# EAGLE design guitar_tuner (EAGLE 9.6.2)
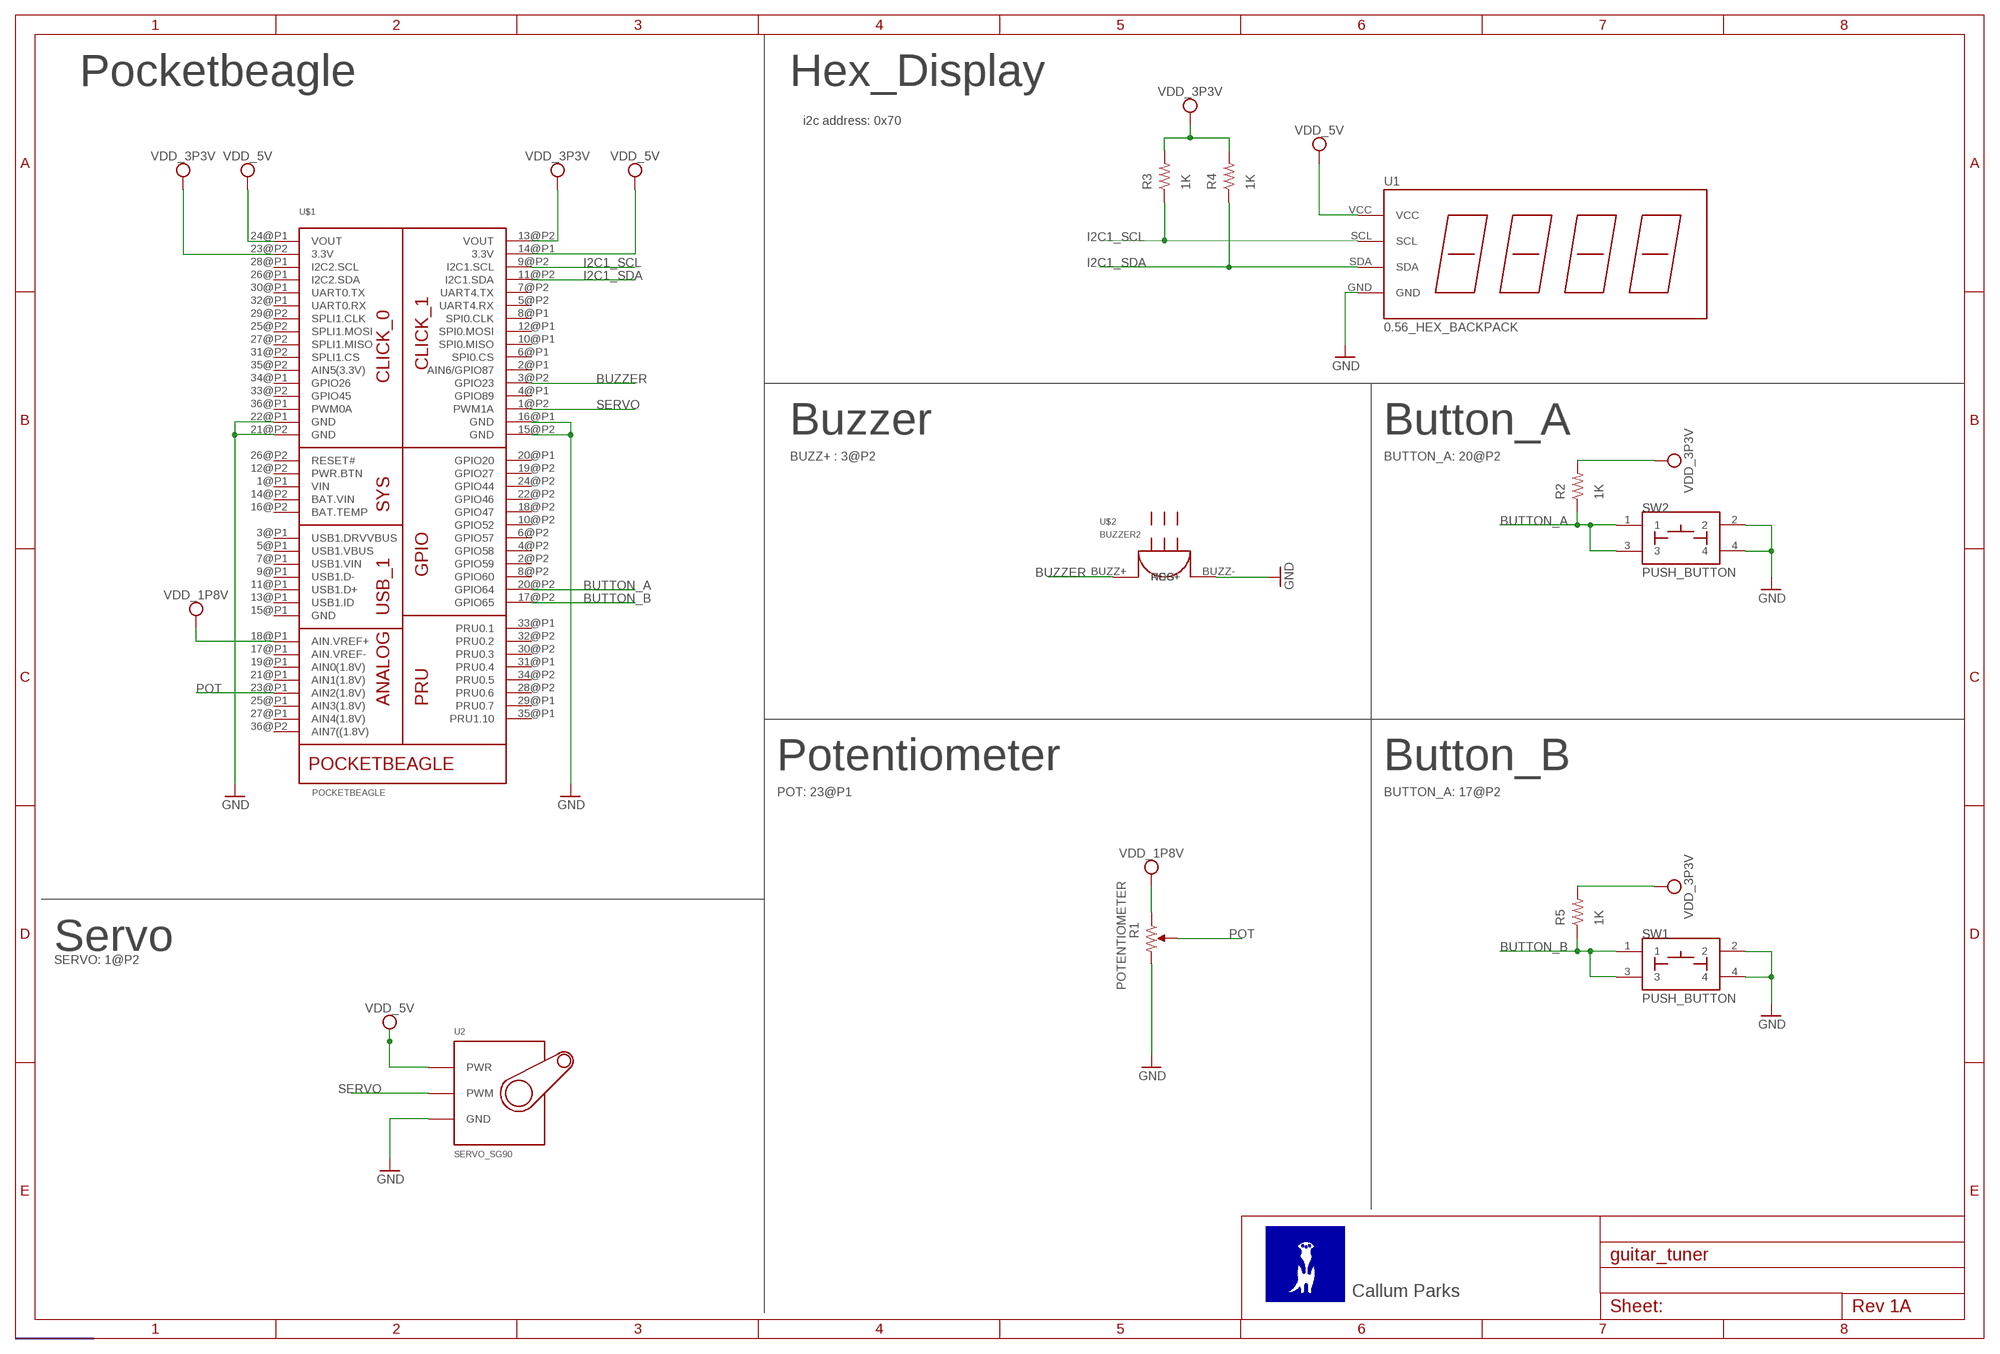
[diagram p0: schematic, sheet 1]

## Parts
R1  POTENTIOMETER  [POT-PO90S]
R2  1K  R_R0402  [R0402]
R3  1K  R_R0402  [R0402]
R4  1K  R_R0402  [R0402]
R5  1K  R_R0402  [R0402]
SW1  PUSH_BUTTON  [BUTTON_12.5MM]
SW2  PUSH_BUTTON  [BUTTON_12.5MM]
U1  0.56_HEX_BACKPACK  [0.56_HEX_BACKPACK]
U2  SERVO_SG90  [SERVO-X1]
U$1  POCKETBEAGLE  [POCKETBEAGLE]
U$2  BUZZER2  [BUZZER2]

## Nets
BUTTON_A: R2.1 SW2.1 SW2.3 U$1.20@P2(GPIO64)
BUTTON_B: R5.1 SW1.1 SW1.3 U$1.17@P2(GPIO65)
BUZZER: U$1.3@P2(GPIO23) U$2.BUZZ+(POS+)
GND: R1.CW SW1.2 SW1.4 SW2.2 SW2.4 U1.GND U2.GND U$1.15@P2(GND) U$1.16@P1(GND) U$1.21@P2(GND) U$1.22@P1(GND) U$2.BUZZ-(NEG-)
I2C1_SCL: U1.SCL U$1.9@P2(I2C1.SCL)
I2C1_SDA: R4.1 U1.SDA U$1.11@P2(I2C1.SDA)
N$1: R3.1
POT: R1.S U$1.23@P1(AIN2(1.8V))
SERVO: U2.SIG(PWM) U$1.1@P2(PWM1A)
VDD_3P3V: R1.CCW R2.2 R3.2 R4.2 R5.2 U$1.13@P2(VOUT) U$1.18@P1(AIN.VREF+) U$1.23@P2(3.3V) ; supply symbol labelled VDD_1P8V
VDD_5V: U1.VCC U2.PWR U$1.14@P1(3.3V) U$1.24@P1(VOUT)
Unconnected: U$1.1@P1(VIN) U$1.2@P1(AIN6/GPIO87) U$1.2@P2(GPIO59) U$1.3@P1(USB1.DRVVBUS) U$1.4@P1(GPIO89) U$1.4@P2(GPIO58) U$1.5@P1(USB1.VBUS) U$1.5@P2(UART4.RX) U$1.6@P1(SPI0.CS) U$1.6@P2(GPIO57) U$1.7@P1(USB1.VIN) U$1.7@P2(UART4.TX) U$1.8@P1(SPI0.CLK) U$1.8@P2(GPIO60) U$1.9@P1(USB1.D-) U$1.10@P1(SPI0.MISO) U$1.10@P2(GPIO52) U$1.11@P1(USB1.D+) U$1.12@P1(SPI0.MOSI) U$1.12@P2(PWR.BTN) U$1.13@P1(USB1.ID) U$1.14@P2(BAT.VIN) U$1.15@P1(GND) U$1.16@P2(BAT.TEMP) U$1.17@P1(AIN.VREF-) U$1.18@P2(GPIO47) U$1.19@P1(AIN0(1.8V)) U$1.19@P2(GPIO27) U$1.20@P1(GPIO20) U$1.21@P1(AIN1(1.8V)) U$1.22@P2(GPIO46) U$1.24@P2(GPIO44) U$1.25@P1(AIN3(1.8V)) U$1.25@P2(SPLI1.MOSI) U$1.26@P1(I2C2.SDA) U$1.26@P2(RESET#) U$1.27@P1(AIN4(1.8V)) U$1.27@P2(SPLI1.MISO) U$1.28@P1(I2C2.SCL) U$1.28@P2(PRU0.6) U$1.29@P1(PRU0.7) U$1.29@P2(SPLI1.CLK) U$1.30@P1(UART0.TX) U$1.30@P2(PRU0.3) U$1.31@P1(PRU0.4) U$1.31@P2(SPLI1.CS) U$1.32@P1(UART0.RX) U$1.32@P2(PRU0.2) U$1.33@P1(PRU0.1) U$1.33@P2(GPIO45) U$1.34@P1(GPIO26) U$1.34@P2(PRU0.5) U$1.35@P1(PRU1.10) U$1.35@P2(AIN5(3.3V)) U$1.36@P1(PWM0A) U$1.36@P2(AIN7((1.8V))

## Notes on the sheet
- Pocketbeagle | Hex_Display
- i2c address: 0x70
- Buzzer | Button_A
- BUZZ+ : 3@P2 | BUTTON_A: 20@P2
- Potentiometer | Button_B
- POT: 23@P1 | BUTTON_A: 17@P2
- Servo
- SERVO: 1@P2
- Callum Parks

## Library data of the parts
R1 = ENGI301:POTENTIOMETER: Potentiometer - Examples: P090S-14T20BR10K (987-1277-ND)
R2-R5 = ENGI301:R_: RESISTOR, American symbol
SW1 SW2 = ENGI301:PUSH_BUTTON
U1 = ENGI301:0.56_HEX_BACKPACK: 0.56" LED HEX Backback - Adafruit HT16K33 - https://www.adafruit.com/product/878 - https://www.adafruit.com/product/879 - https://www.adafruit.com/product/880 - https://www.adafruit.com/product/881 - https://www.adafruit.com/product/1002
U2 = ENGI301:SERVO_SG90
U$1 = ENGI301:POCKETBEAGLE
U$2 = ENGI301:BUZZER2

## Board
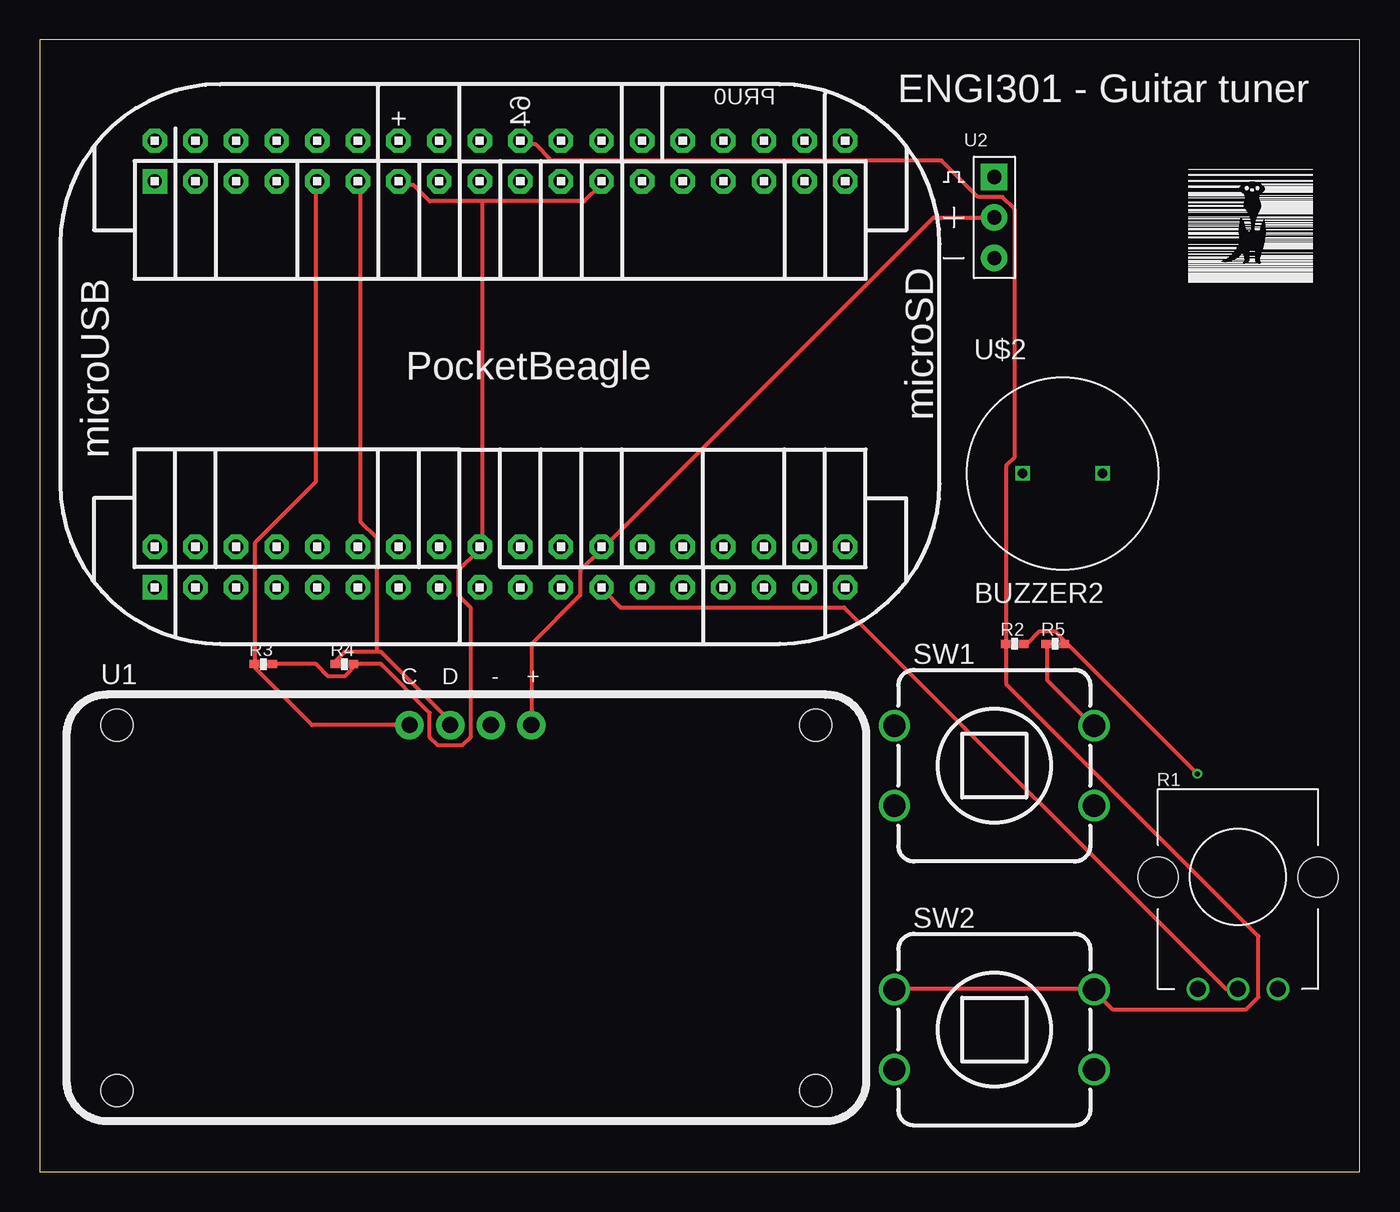
[diagram p1: board, top side]
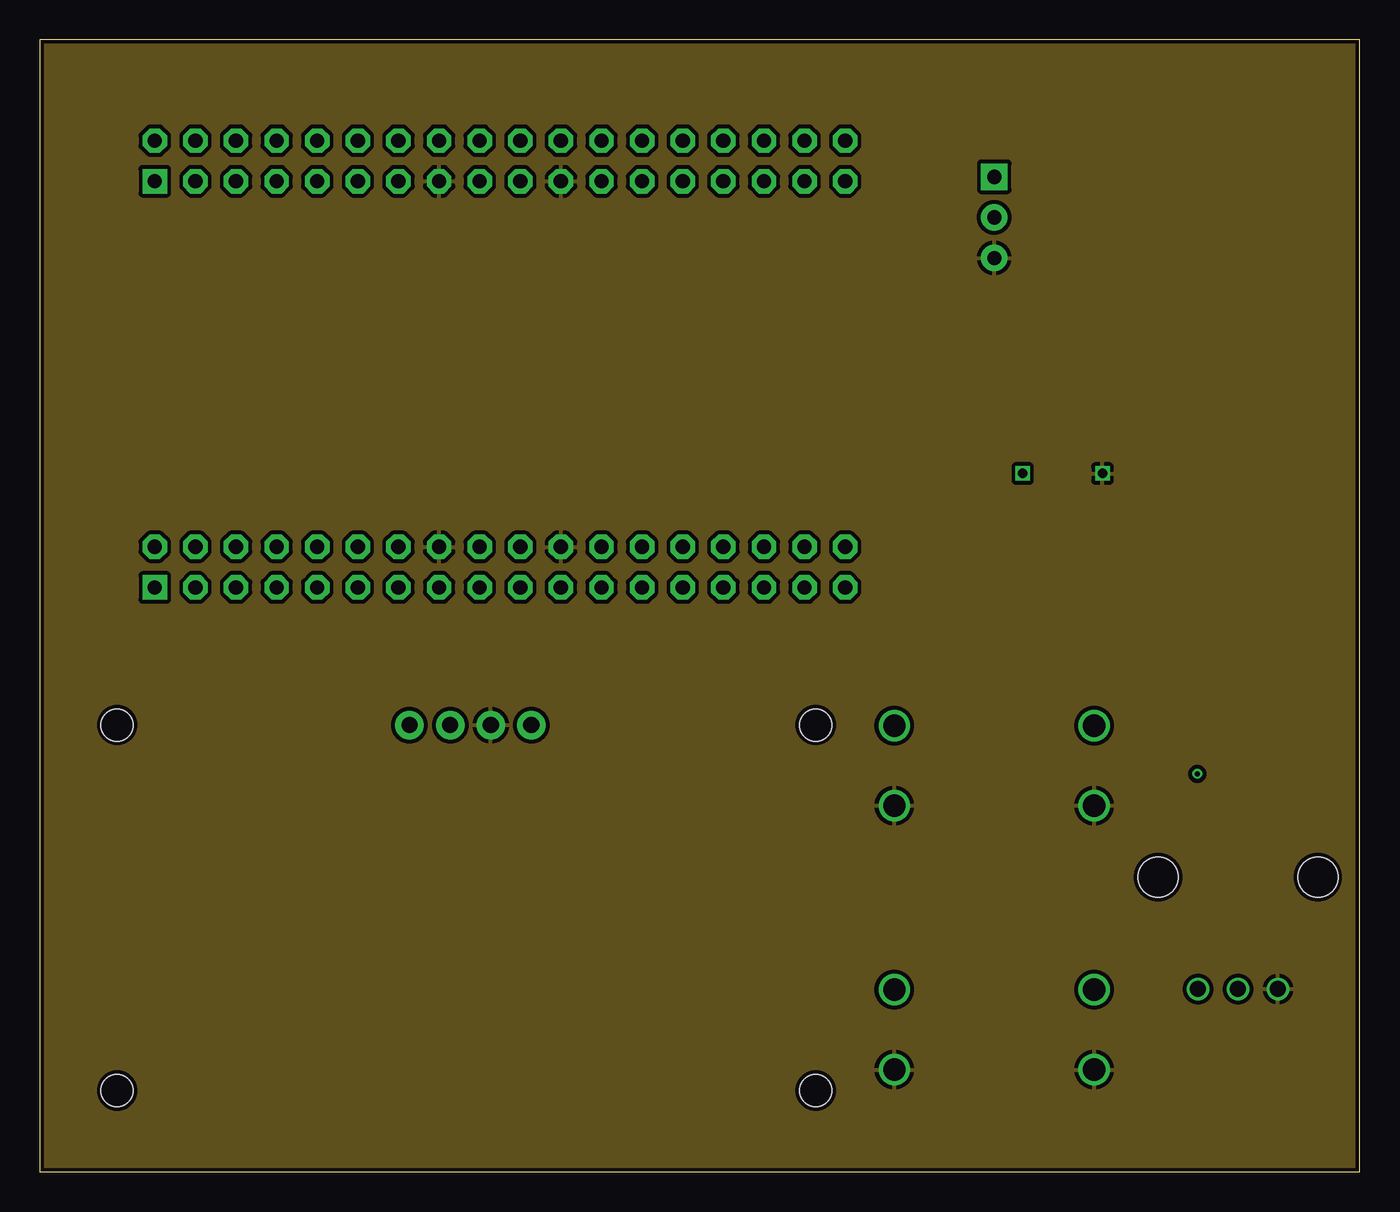
[diagram p2: board, inner layer Route2]
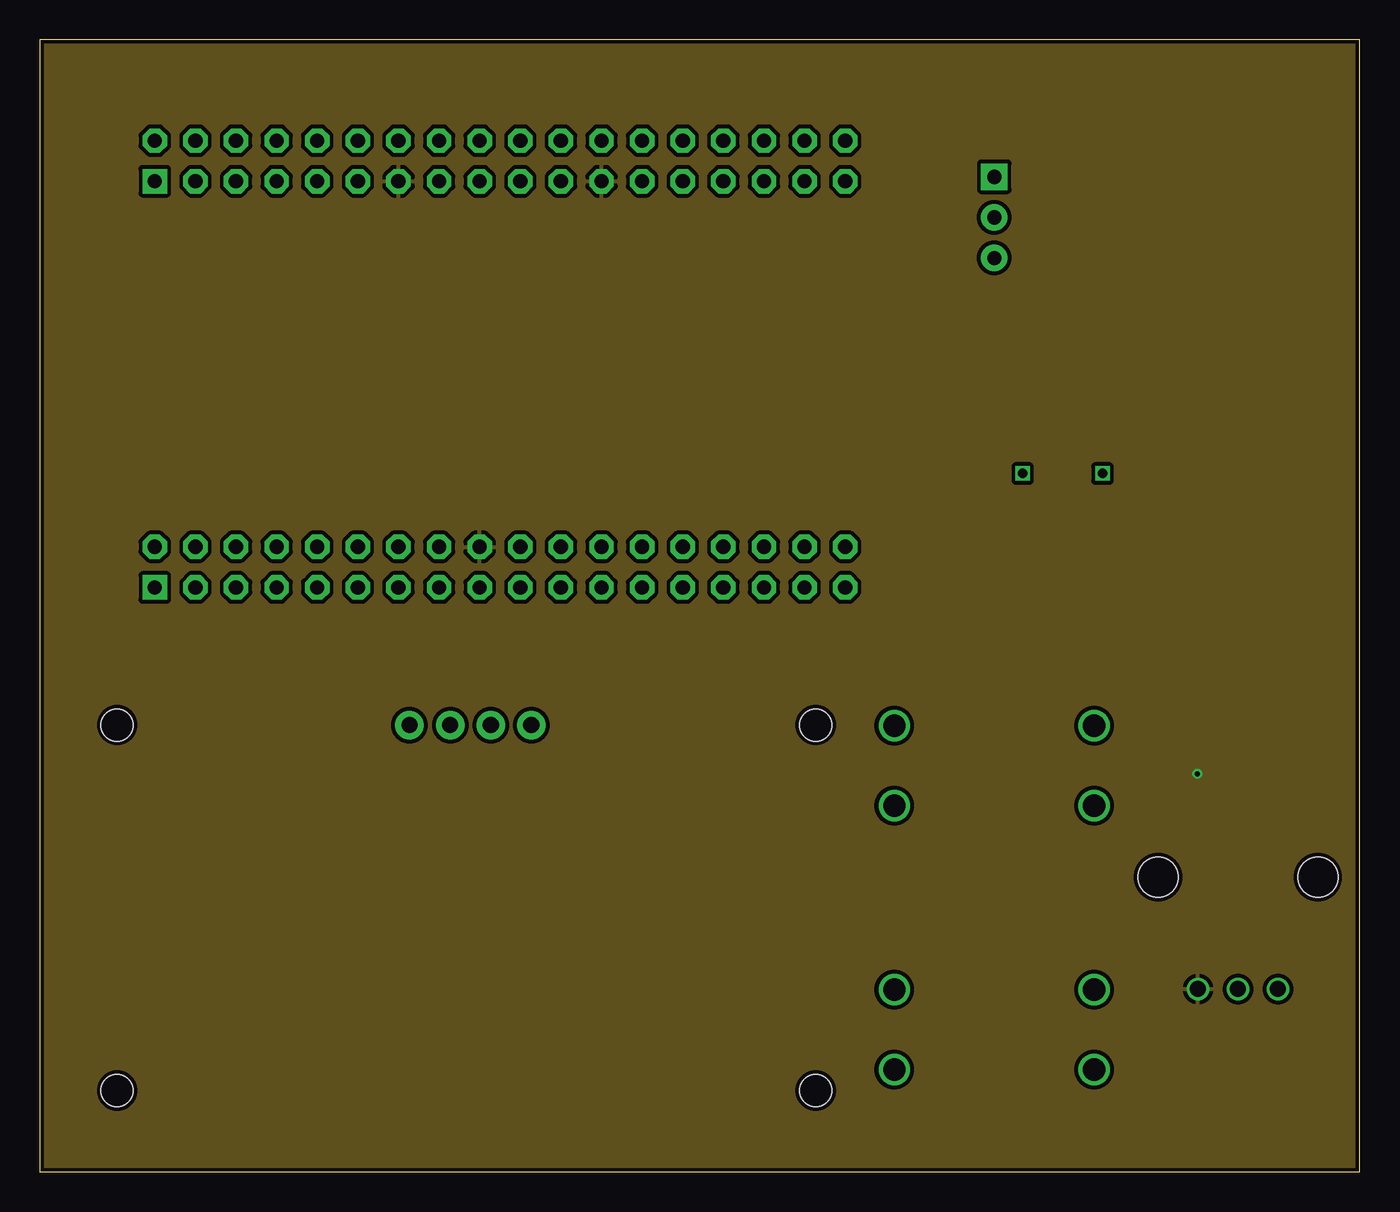
[diagram p3: board, inner layer Route15]
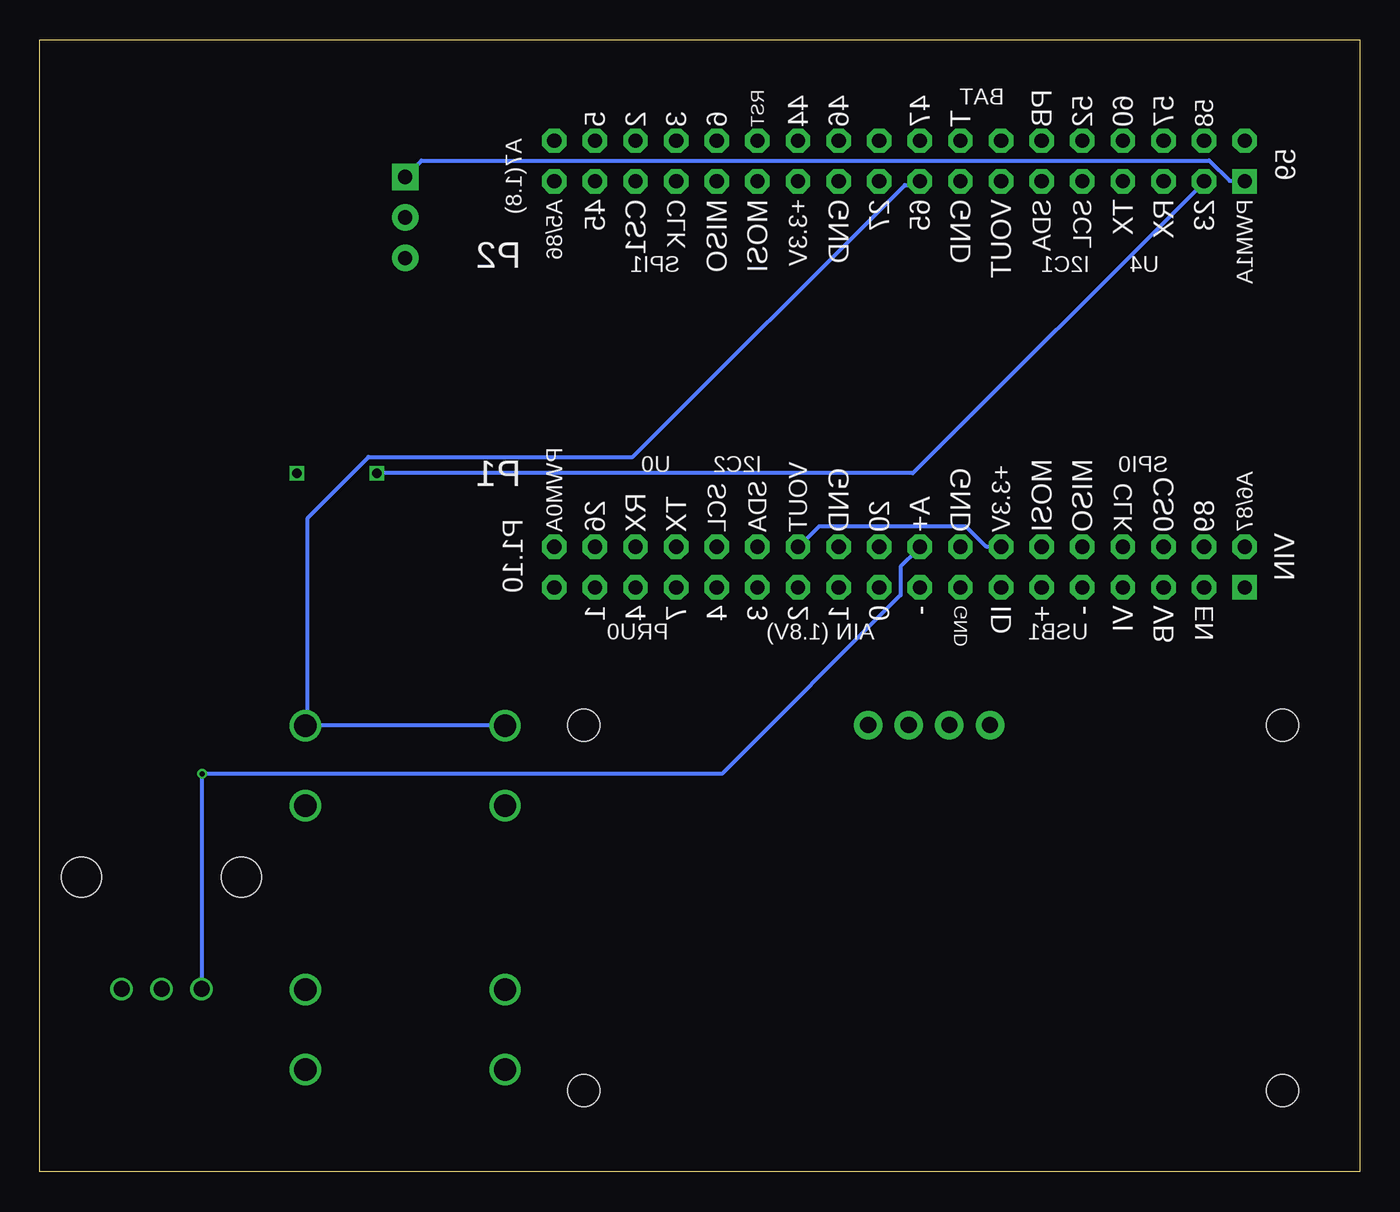
[diagram p4: board, bottom side, seen from below]

Size 82.53 x 70.79 mm. Coordinates in mm from the lower left corner, seen from the top.
Outline: 0,0 82.53,0 82.53,70.79 0,70.79 0,0
Copper layers (1*2*15*16): Top 0.035mm / dielectric 0.23mm / Route2 0.035mm / dielectric 0.93mm / Route15 0.035mm / dielectric 0.23mm / Bottom 0.035mm
Design rules "ENGI301_4lyr": minimum track width 10mil, minimum drill 12mil, track to track 10mil, track to pad 10mil, pad to pad 10mil, via to via 10mil, smd to smd 10mil, copper to edge 10mil, drill to drill 12mil, minimum pad ring 6mil, minimum via ring 6mil, stop-mask expansion 3mil, vias tented up to drill 25mil, thermal gap 10mil

### Footprints (pad centres in the part's own frame; a part is rotated, then mirrored left to right if it is on the bottom)
POT-PO90S = drill 1: CCW -2.5,0; CW 2.5,0; S 0,0 | hole 2.5: -5,7; 5,7
R0402 = smd 0.61 x 0.508: 1 -0.559,0; 2 0.559,0
BUTTON_12.5MM = drill 1.4: 1 -6.25,2.5; 2 -6.25,-2.5; 3 6.25,2.5; 4 6.25,-2.5
0.56_HEX_BACKPACK = drill 1.016 pad 1.778: GND 1.524,11.43; SCL -3.556,11.43; SDA -1.016,11.43; VCC 4.064,11.43 | hole 2: -21.844,-11.43; 21.844,-11.43; -21.844,11.43; 21.844,11.43
SERVO-X1 = drill 0.889 pad 1.651: GND 0,-2.54; PWR 0,0 | drill 0.889 pad 1.651 square: SIG 0,2.54
POCKETBEAGLE = drill 0.889 pad 1.524 square: 1@P1 5.91,3.53; 1@P2 5.91,28.93 | drill 0.889 pad 1.524 octagon: 2@P1 5.91,6.07; 2@P2 5.91,31.47; 3@P1 8.45,3.53; 3@P2 8.45,28.93; 4@P1 8.45,6.07; 4@P2 8.45,31.47; 5@P1 10.99,3.53; 5@P2 10.99,28.93; 6@P1 10.99,6.07; 6@P2 10.99,31.47; 7@P1 13.53,3.53; 7@P2 13.53,28.93; 8@P1 13.53,6.07; 8@P2 13.53,31.47; 9@P1 16.07,3.53; 9@P2 16.07,28.93; 10@P1 16.07,6.07; 10@P2 16.07,31.47; 11@P1 18.61,3.53; 11@P2 18.61,28.93; 12@P1 18.61,6.07; 12@P2 18.61,31.47; 13@P1 21.15,3.53; 13@P2 21.15,28.93; 14@P1 21.15,6.07; 14@P2 21.15,31.47; 15@P1 23.69,3.53; 15@P2 23.69,28.93; 16@P1 23.69,6.07; 16@P2 23.69,31.47; 17@P1 26.23,3.53; 17@P2 26.23,28.93; 18@P1 26.23,6.07; 18@P2 26.23,31.47; 19@P1 28.77,3.53; 19@P2 28.77,28.93; 20@P1 28.77,6.07; 20@P2 28.77,31.47; 21@P1 31.31,3.53; 21@P2 31.31,28.93; 22@P1 31.31,6.07; 22@P2 31.31,31.47; 23@P1 33.85,3.53; 23@P2 33.85,28.93; 24@P1 33.85,6.07; 24@P2 33.85,31.47; 25@P1 36.39,3.53; 25@P2 36.39,28.93; 26@P1 36.39,6.07; 26@P2 36.39,31.47; 27@P1 38.93,3.53; 27@P2 38.93,28.93; 28@P1 38.93,6.07; 28@P2 38.93,31.47; 29@P1 41.47,3.53; 29@P2 41.47,28.93; 30@P1 41.47,6.07; 30@P2 41.47,31.47; 31@P1 44.01,3.53; 31@P2 44.01,28.93; 32@P1 44.01,6.07; 32@P2 44.01,31.47; 33@P1 46.55,3.53; 33@P2 46.55,28.93; 34@P1 46.55,6.07; 34@P2 46.55,31.47; 35@P1 49.09,3.53; 35@P2 49.09,28.93; 36@P1 49.09,6.07; 36@P2 49.09,31.47
BUZZER2 = drill 0.6 square: BUZZ+ 0.5,0.5; BUZZ- 5.5,0.5

### Placement (x,y rotation side)
R1  74.93,11.43 0 top
R2  60.96,33.02 0 top
R3  13.97,31.75 0 top
R4  19.05,31.75 0 top
R5  63.5,33.02 0 top
SW1  59.69,25.4 0 top
SW2  59.69,8.89 0 top
U1  26.67,16.51 0 top
U2  59.69,59.69 0 top
U$1  1.27,33.02 0 top
U$2  60.96,43.18 0 top

### Tracks (layer width: path | path; a pad name or v marks a point on that pad's centre or on a via)
BUTTON_A
  Top 0.254: 60.45,33.02 60.45,30.48 76.2,14.73 76.2,10.92 75.44,10.16 67.06,10.16 66.04,11.18 SW2.3 65.79,11.43 53.59,11.43 SW2.1 | 60.45,33.02 60.45,44.2 60.96,44.7 60.96,60.2 60.2,60.96 58.67,60.96 56.39,63.25 32,63.25 30.99,64.26 30.23,64.26 U$1.20@P2 | 60.45,33.02 R2.1
BUTTON_B
  Top 0.254: R5.1 62.99,33.02 62.99,30.73 65.79,27.94 SW1.3
  Bottom 0.254: 65.79,27.94 65.79,40.89 61.98,44.7 45.47,44.7 28.45,61.72 27.69,61.72 U$1.17@P2 | 65.79,27.94 53.59,27.94 SW1.1 | 65.79,27.94 SW1.3
BUZZER
  Bottom 0.254: U$2.BUZZ+ 61.21,43.69 27.94,43.69 9.91,61.72 U$1.3@P2
GND
  pour Route2: -1.27,72.39 83.82,72.39 83.82,-1.27 -1.27,-1.27
I2C1_SCL
  Top 0.254: U1.SCL 17.02,27.94 13.46,31.5 13.46,39.37 17.27,43.18 17.27,61.72 U$1.9@P2
I2C1_SDA
  Top 0.254: 21.08,32.51 21.34,32.51 25.65,28.19 U1.SDA | 21.08,32.51 19.05,32.51 18.54,32 18.54,31.75 R4.1 | 21.08,32.51 21.08,39.62 20.07,40.64 20.07,61.72 U$1.11@P2
POT
  Top 0.254: R1.S 74.17,11.43 50.29,35.31 36.32,35.31 35.31,36.32 U$1.23@P1
SERVO
  Bottom 0.254: U2.SIG 58.67,63.25 9.4,63.25 8.13,61.98 7.37,61.98 U$1.1@P2
VDD_3P3V  (via drill 0.3)
  Top 0.254: 64.26,33.02 63.5,33.78 62.48,33.78 61.72,33.02 R2.2 | v72.39,24.89 64.26,33.02 | 64.26,33.02 R5.2 | 27.69,60.71 34.04,60.71 35.05,61.72 U$1.23@P2 | 27.69,60.71 24.38,60.71 23.37,61.72 22.61,61.72 U$1.13@P2 | R3.2 17.27,31.75 18.03,30.99 19.05,30.99 19.81,31.75 | 19.81,31.75 21.34,31.75 24.38,28.7 24.38,27.18 24.89,26.67 26.42,26.67 26.92,27.18 26.92,35.31 26.16,36.07 26.16,37.59 27.43,38.86 U$1.18@P1 27.69,39.12 27.69,60.71 | 19.81,31.75 R4.2
  Bottom 0.254: R1.CCW 72.39,11.43 v72.39,24.89 39.88,24.89 28.7,36.07 28.7,37.85 27.69,38.86 U$1.18@P1
  pour Route15: -2.54,-2.54 85.09,-2.54 85.09,73.66 -2.54,73.66
VDD_5V
  Top 0.254: U2.PWR 55.88,59.69 35.31,39.12 U$1.24@P1 35.05,38.86 33.78,37.59 33.78,36.07 30.73,33.02 U1.VCC
  Bottom 0.254: U$1.14@P1 22.61,39.12 23.37,39.12 24.64,40.39 33.78,40.39 35.05,39.12 U$1.24@P1

### Text on the board
tPlace: ENGI301 - Guitar tuner